# Altium schematic sheet 04_POWER_2.SchDoc
size A3; SheetNumber: 4; SheetTotal: 13
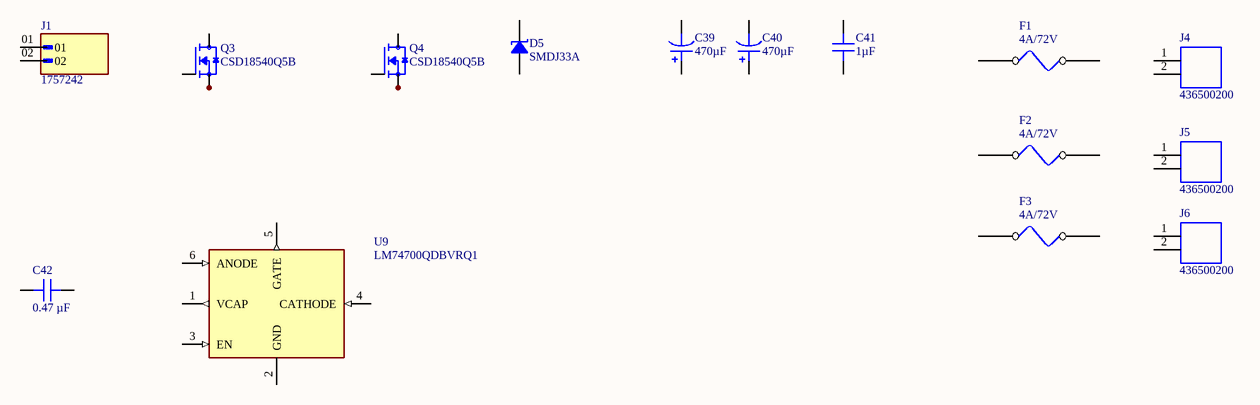
[diagram p0: 04_POWER_2.SchDoc]

## Parts
C39  470µF  [CAP TH ALUM ELEC D10.00mm S5.00mm H22.00mm]
C40  470µF  [CAP TH ALUM ELEC D10.00mm S5.00mm H22.00mm]
C41  1µF  [CAP 0805_2012]
C42  0.47 µF  [CAP 0603_1608]
D5  SMDJ33A  [DO214AB SMC]
F1  4A/72V  [F1206]
F2  4A/72V  [F1206]
F3  4A/72V  [F1206]
J1  1757242  [PHOENIX_1757242]
J4  436500200  [CONN_SD-43650-001_02_MOL]
J5  436500200  [CONN_SD-43650-001_02_MOL]
J6  436500200  [CONN_SD-43650-001_02_MOL]
Q3  CSD18540Q5B  [TRANS_CSD18540Q5B]
Q4  CSD18540Q5B  [TRANS_CSD18540Q5B]
U9  LM74700QDBVRQ1  [SOT95P280X145-6N/LM74700QDBVRQ1]

## Nets
NetQ3_1: Q3.1(S) Q3.2(S) Q3.3(S)
NetQ4_1: Q4.1(S) Q4.2(S) Q4.3(S)

Not connected (* = marked no-connect by the designer): C39 1 2; C40 1 2; C41 1 2; C42 1 2; D5 1 2; F1 1 2; F2 1 2; F3 1 2; J1 01 02; J4 1 2; J5 1 2; J6 1 2; Q3 4(G) 5_6_7_8(D); Q4 4(G) 5_6_7_8(D); U9 1(VCAP) 2(GND) 3(EN) 4(CATHODE) 5(GATE) 6(ANODE)

## Library data of the parts
C39 C40 = ECA-1HM471: CAP ALUM 470UF 20% 50V RADIAL; manufacturer: Panasonic Electronic Components; Lifetime @ Temp.: 2000 Hrs @ 85°C; Polarization: Polar; Ripple Current @ High Frequency: 1.105A @ 10kHz; Ripple Current @ Low Frequency: 650mA @ 120Hz; Part Number: ECA-1HM471; Applications: General Purpose; Capacitance: 470µF; componentlink1description: Datasheet; componentlink1url: //media.digikey.com/pdf/Data%20Sheets/Panasonic%20Electronic%20Components/ECA-xxM%20Series,TypeA.pdf; componentlink2description: DigiKey Link; componentlink2url: http://digikey.com/product-detail/en/panasonic-electronic-components/ECA-1HM471/P5185-ND/245044; Device Package: Radial, Can; Height - Seated (Max): 0.866" (22.00mm); lastupdated: 2.09.2020 01:31:40; Lead Spacing: 0.197" (5.00mm); Lifecycle Status: Active; Minimum Order: 1; Mounting Type: Through Hole; Operating Temperature: -40°C ~ 85°C; Package / Case: Radial, Can; packaging: Bulk; partid: 13256; Part Status: Active; price: 0.64; series: M; Size / Dimension: 0.394" Dia (10.00mm); Supplier 1: DigiKey; Supplier Part Number 1: P5185-ND; Tolerance: ±20%; value: 470µF; Voltage - Rated: 50V
C41 = 08051C105K4T2A: CAP CER 1UF 100V X7R 0805; manufacturer: AVX Corporation; Tolerance: ±10%; Part Number: 08051C105K4T2A; Capacitance: 1µF; Applications: Automotive; componentlink1description: Datasheet; componentlink1url: http://datasheets.avx.com/AutoMLCC.pdf; componentlink2description: DigiKey Link; componentlink2url: http://digikey.com/product-detail/en/avx-corporation/08051C105K4T2A/478-12142-1-ND/9374711; Device Package: 0805 (2012 Metric); lastupdated: 2.09.2020 01:04:22; Lifecycle Status: Active; Minimum Order: 1; Mounting Type: Surface Mount, MLCC; Operating Temperature: -55°C ~ 125°C; Package / Case: 0805 (2012 Metric); packaging: TapeAndReel; partid: 13414; Part Status: Active; price: 0.09; Ratings: AEC-Q200; series: -; Size / Dimension: 0.079" L x 0.049" W (2.01mm x 1.25mm); Supplier 1: DigiKey; Supplier Part Number 1: 478-12142-1-ND; Temperature Coefficient: X7R; value: 1µF; Voltage - Rated: 100V
C42 = CL10A474KA8NNNC: CAP CER 0.47UF 25V X5R 0603; manufacturer: Samsung Electro-Mechanics; Tolerance: ±10%; Part Number: CL10A474KA8NNNC; Capacitance: 0.47 µF; Applications: General Purpose; componentlink1description: Datasheet; componentlink1url: http://www.samsungsem.com/kr/support/product-search/mlcc/CL10A474KA8NNNC.jsp; componentlink2description: DigiKey Link; componentlink2url: https://www.digikey.com/en/products/detail/samsung-electro-mechanics/CL10A474KA8NNNC/3887553; Device Package: 0603 (1608 Metric); lastupdated: 6.04.2026 19:23:45; Lifecycle Status: Active; Minimum Order: 1; Mounting Type: Surface Mount, MLCC; Operating Temperature: -55°C ~ 85°C; Package / Case: 0603 (1608 Metric); packaging: TapeAndReel; partid: 4224; Part Status: Active; price: 0.01; series: CL; Size / Dimension: 0.063" L x 0.031" W (1.60mm x 0.80mm); Supplier 1: DigiKey; Supplier Part Number 1: 1276-1895-1-ND; Temperature Coefficient: X5R; Thickness (Max): 0.035" (0.90mm); value: 0.47 µF; Voltage - Rated: 25V
D5 = SMDJ33A: TVS DIODE 33VWM 53.3VC DO214AB; Manufacturer: Littelfuse Inc.; Current - Peak Pulse (10/1000µs): 56.3A; Power Line Protection: No; Power - Peak Pulse: 3000W (3kW); Type: Zener; Unidirectional Channels: 1; Voltage - Breakdown (Min): 36.7V; Voltage - Clamping (Max) @ Ipp: 53.3V; Voltage - Reverse Standoff (Typ): 33V; Part Number: SMDJ33A; Applications: General Purpose; ComponentLink1Description: Datasheet; ComponentLink1URL: https://www.littelfuse.com/~/media/electronics/datasheets/tvs_diodes/littelfuse_tvs_diode_smdj_datasheet.pdf.pdf; ComponentLink2Description: DigiKey Link; ComponentLink2URL: https://www.digikey.com/en/products/detail/littelfuse-inc/SMDJ33A/1835325; LastUpdated: 5.04.2026 20:34:02; Lifecycle Status: Active; Minimum Order: 1; Mounting Type: Surface Mount; Operating Temperature: -65°C ~ 150°C (TJ); Package / Case: DO-214AB, SMC; Packaging: TapeAndReel; PartId: 7128; Part Status: Active; Price: 0.33; Series: SMDJ; Supplier 1: DigiKey; Supplier Part Number 1: SMDJ33ACT-ND; Supplier Device Package: DO-214AB (SMCJ)
F1-F3 = Fuse: Fuse,Resettable 4A 75V,SMD 1206,TLC; Manufacturer P/N: F12F4; Myir P/N: 20801.00014; Datasheet: F12F Series.pdf; Reserve Value: 4A; Manufacturer: TLC; Part Type: Resettable Fuse; PCB Footprint: F1206
J1 = 1757242: Pluggable Header 5.08mm 12AWG 320V 12A 2 Position COMBICON MSTBA Series | Phoenix Contact 1757242; SnapEDA_Link: https://www.snapeda.com/parts/1757242/Phoenix+Contact/view-part/?ref=snap; Package: None; Value: *; MF: Phoenix Contact; MP: 1757242; Check_prices: https://www.snapeda.com/parts/1757242/Phoenix+Contact/view-part/?ref=eda
J4-J6 = 436500200: Connector Header Through Hole, Right Angle 2 position 0.118 (3.00mm); MF: Molex; SnapEDA_Link: https://www.snapeda.com/parts/436500200/Molex/view-part/?ref=snap; Package: None; Value: *; MP: 436500200; Check_prices: https://www.snapeda.com/parts/436500200/Molex/view-part/?ref=eda
Q3 Q4 = CSD18540Q5B: 60-V, N channel NexFETâ„¢ power MOSFET, single SON 5 mm x 6 mm, 2.2 mOhm; MF: Texas Instruments; SnapEDA_Link: https://www.snapeda.com/parts/CSD18540Q5B/Texas+Instruments/view-part/?ref=snap; Package: VSON-CLIP-8 Texas Instruments; Value: *; MP: CSD18540Q5B; Check_prices: https://www.snapeda.com/parts/CSD18540Q5B/Texas+Instruments/view-part/?ref=eda
U9 = LM74700QDBVRQ1: OR Controller N+1 ORing Controller N-Channel 1:1 SOT-23-6